# EAGLE design jacarerele2 (EAGLE 6.5.0)
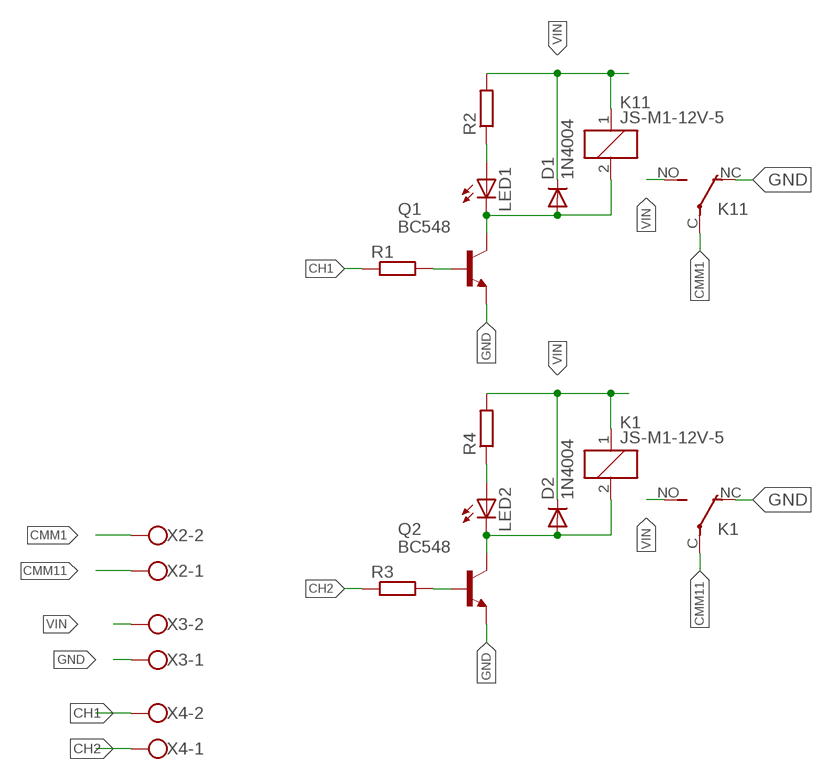
[diagram p0: schematic, sheet 1]

## Parts
D1  1N4004  [DO41-10]
D2  1N4004  [DO41-10]
K1  JS-M1-12V-5  [JS-M]
K11  JS-M1-12V-5  [JS-M]
LED1  LED5MM  [LED5MM]
LED2  LED5MM  [LED5MM]
Q1  BC548  [TO92-EBC]
Q2  BC548  [TO92-EBC]
R1  R-EU_0207/10  [0207/10]
R2  R-EU_0207/10  [0207/10]
R3  R-EU_0207/10  [0207/10]
R4  R-EU_0207/10  [0207/10]
X2  W237-102  [W237-102]
X3  W237-102  [W237-102]
X4  W237-102  [W237-102]

## Nets
CH1: R1.1 X4.2
CH2: R3.1 X4.1
CMM1: K11.C(2:P) X2.2
CMM11: K1.C(2:P) X2.1
GND: K1.NC(2:O) K11.NC(2:O) Q1.E Q2.E X3.1
N$1: Q1.B R1.2
N$2: LED1.A R2.1
N$3: Q2.B R3.2
N$4: LED2.A R4.1
N$5: D1.A K11.2 LED1.K(C) Q1.C
N$6: D2.A K1.2 LED2.K(C) Q2.C
VIN: D1.C D2.C K1.1 K1.NO(2:S) K11.1 K11.NO(2:S) R2.2 R4.2 X3.2

## Library data of the parts
D1 D2 = diode:1N4004: DIODE general purpose rectifier, 1 A
K1 K11 = relay:JS-M1*: Automotive Ultra-Miniature Power Relay NAiS Source: http://www.mew-europe.com/.. en_ds_61211_0000.pdf; MF: FARNELL; MPN: JSM1-12V-5; OC_FARNELL: 910351; OC_NEWARK: 14J1764
LED1 LED2 = led:LED: LED OSRAM: - CHIPLED LG R971, LG N971, LY N971, LG Q971, LY Q971, LO R971, LY R971 LH N974, LH R974 LS Q976, LO Q976, LY Q976 LO Q996 - Hyper CHIPLED LW Q18S LB Q993, LB Q99A, LB R99A - SideLED LS A670, LO A670, LY A670, LG A670, LP A670 LB A673, LV A673, LT A673, LW A673 LH A674 LY A675 LS A676, LA A676, LO A676, LY A676, LW A676 LS A679, LY A679, LG A679 - Hyper Micro SIDELED® LS Y876, LA Y876, LO Y876, LY Y876 LT Y87S - SmartLED LW L88C, LW L88S LB L89C, LB L89S, LG L890 LS L89K, LO L89K, LY L89K LS L896, LA L896, LO L896, LY L896 - TOPLED LS T670, LO T670, LY T670, LG T670, LP T670 LSG T670, LSP T670, LSY T670, LOP T670, LYG T670 LG T671, LOG T671, LSG T671 LB T673, LV T673, LT T673, LW T673 LH T674 LS T676, LA T676, LO T676, LY T676, LB T676, LH T676, LSB T676, LW T676 LB T67C, LV T67C, LT T67C, LS T67K, LO T67K, LY T67K, LW E67C LS E67B, LA E67B, LO E67B, LY E67B, LB E67C, LV E67C, LT E67C LW T67C LS T679, LY T679, LG T679 LS T770, LO T770, LY T770, LG T770, LP T770 LB T773, LV T773, LT T773, LW T773 LH T774 LS E675, LA E675, LY E675, LS T675 LS T776, LA T776, LO T776, LY T776, LB T776 LHGB T686 LT T68C, LB T68C - Hyper Mini TOPLED® LB M676 - Mini TOPLED Santana® LG M470 LS M47K, LO M47K, LY M47K Source: http://www.osram.convergy.de LUXEON: - LUMILED® LXK2-PW12-R00, LXK2-PW12-S00, LXK2-PW14-U00, LXK2-PW14-V00 LXK2-PM12-R00, LXK2-PM12-S00, LXK2-PM14-U00 LXK2-PE12-Q00, LXK2-PE12-R00, LXK2-PE12-S00, LXK2-PE14-T00, LXK2-PE14-U00 LXK2-PB12-K00, LXK2-PB12-L00, LXK2-PB12-M00, LXK2-PB14-N00, LXK2-PB14-P00, LXK2-PB14-Q00 LXK2-PR12-L00, LXK2-PR12-M00, LXK2-PR14-Q00, LXK2-PR14-R00 LXK2-PD12-Q00, LXK2-PD12-R00, LXK2-PD12-S00 LXK2-PH12-R00, LXK2-PH12-S00 LXK2-PL12-P00, LXK2-PL12-Q00, LXK2-PL12-R00 Source: www.luxeon.com KINGBRIGHT: KA-3528ASYC Source: www.kingbright.com
Q1 Q2 = transistor-npn:BC548*: NPN Transistor
R1-R4 = rcl:R-EU_: RESISTOR, European symbol
X2-X4 = con-wago-500:W237-102: WAGO SCREW CLAMP; MPN: 237-102; OC_FARNELL: unknown; OC_NEWARK: 70K9898

## Board
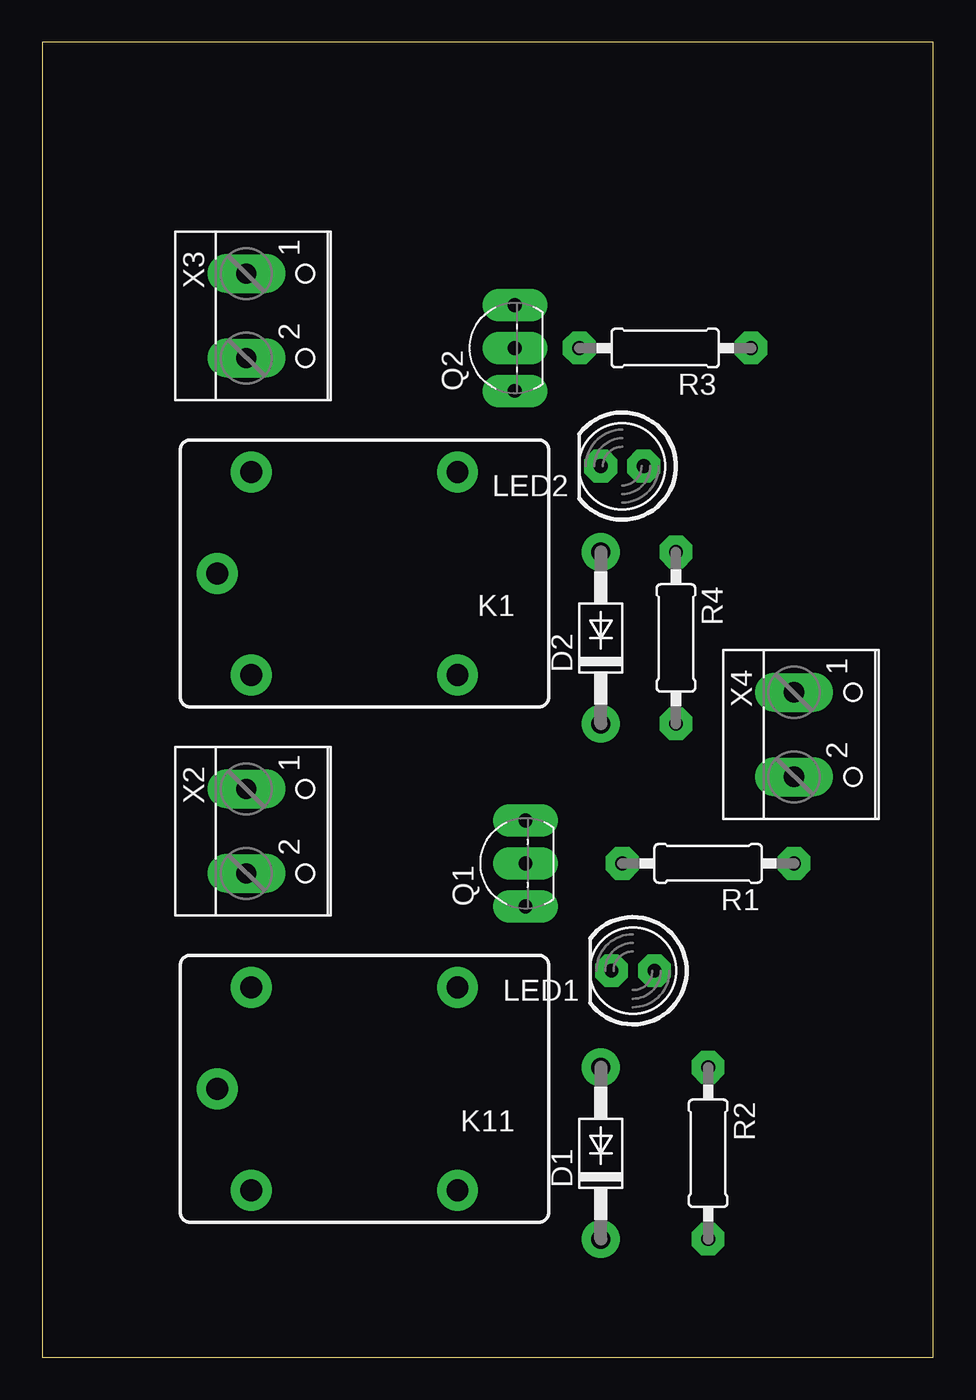
[diagram p1: board, top side]
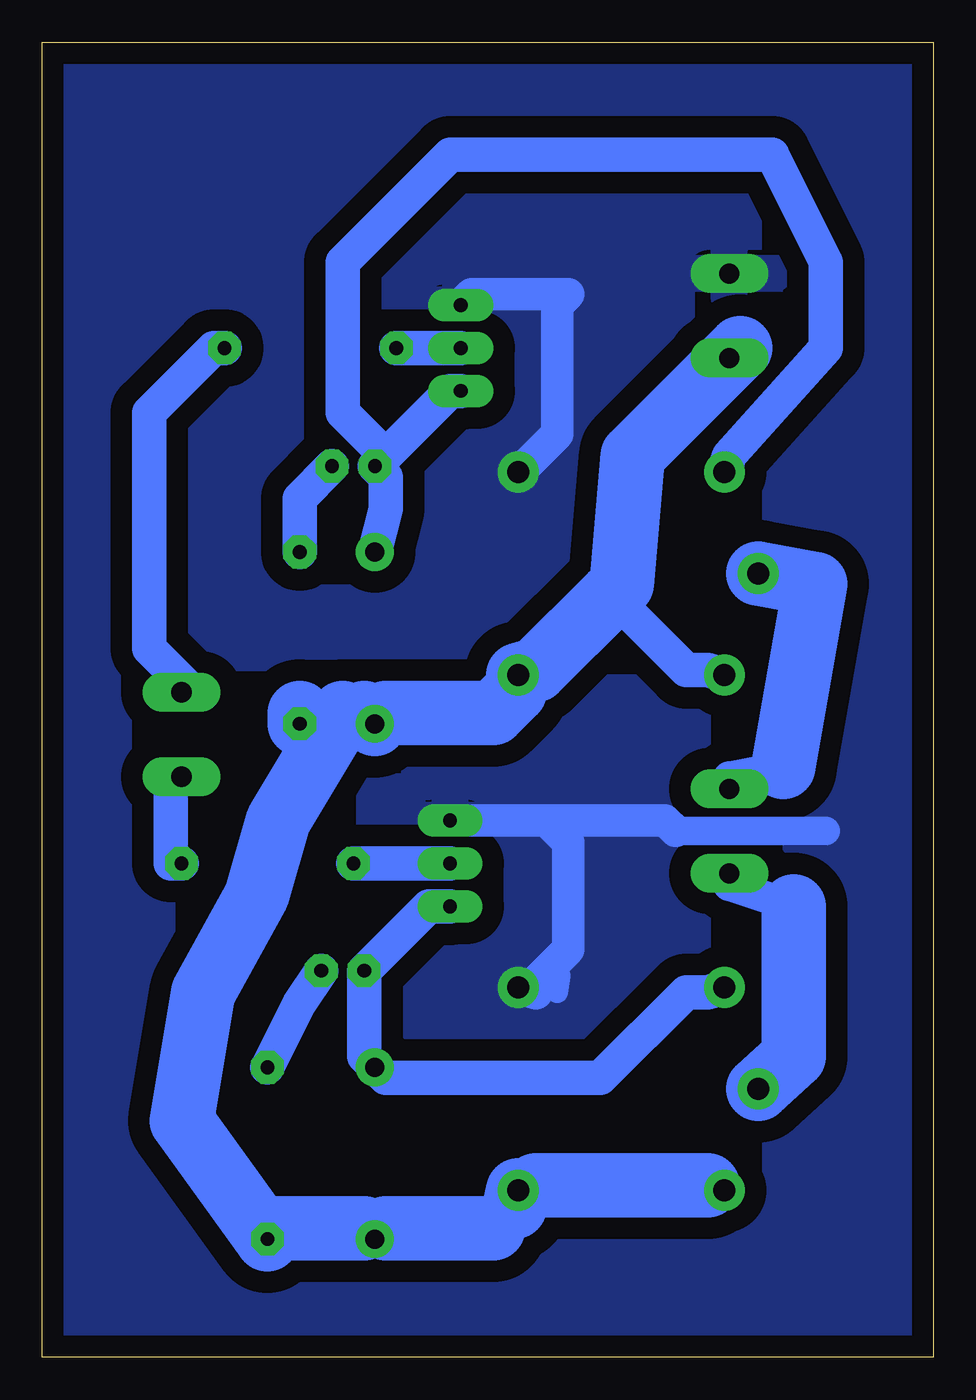
[diagram p2: board, bottom side, seen from below]

Size 52.69 x 77.78 mm. Coordinates in mm from the lower left corner, seen from the top.
Outline: 0,0 52.69,0 52.69,77.78 0,77.78 0,0
Copper layers (1*16): Top 0.035mm / dielectric 1.5mm / Bottom 0.035mm
Design rules "default *": minimum track width 20mil, minimum drill 20mil, track to track 20mil, track to pad 20mil, pad to pad 20mil, via to via 20mil, smd to smd 10mil, copper to edge 40mil, drill to drill 40mil, minimum pad ring 22mil, minimum via ring 20mil, stop-mask expansion 4mil, vias tented up to drill 0mil, thermal gap 10mil

### Footprints (pad centres in the part's own frame; a part is rotated, then mirrored left to right if it is on the bottom)
DO41-10 = drill 1.118: A 5.08,0; C -5.08,0
JS-M = drill 1.3: 1 6.7,6; 2 6.7,-6; C 8.7,0; NC -5.5,-6; NO -5.5,6
LED5MM = drill 0.813 octagon: A -1.27,0; K 1.27,0
TO92-EBC = drill 0.813 long: B 0,-1.27; C -2.54,-1.27; E 2.54,-1.27
0207/10 = drill 0.813 octagon: 1 -5.08,0; 2 5.08,0
W237-102 = drill 1.194 long: 1 -2.5,-1.27; 2 2.5,-1.27

### Placement (x,y rotation side)
D1  33.02,12.07 90 top
D2  33.02,42.55 90 top
K1  19.05,46.36 180 top
K11  19.05,15.88 180 top
LED1  34.93,22.86 180 top
LED2  34.29,52.7 180 top
Q1  27.3,29.21 90 top
Q2  26.67,59.69 90 top
R1  39.37,29.21 180 top
R2  39.37,12.07 270 top
R3  36.83,59.69 180 top
R4  37.47,42.55 270 top
X2  13.34,31.12 270 top
X3  13.34,61.59 270 top
X4  45.72,36.83 270 top

### Tracks (layer width: path | path; a pad name or v marks a point on that pad's centre or on a via)
CH1
  Bottom 2.032: R1.1 45.09,29.21 45.09,34.29 X4.2
CH2
  Bottom 2.032: R3.1 42.55,59.69 46.36,55.88 46.36,41.91 43.82,39.37 X4.1
CMM1
  Bottom 1.93: 8.26,26.67 12.07,27.94 X2.2
  Bottom 3.81: 8.26,26.67 8.26,17.78 K11.C
CMM11
  Bottom 1.93: 8.89,34.93 12.07,34.29 X2.1
  Bottom 3.81: 8.89,34.93 6.99,45.72 K1.C
GND
  Bottom 1.27: 22.23,21.59 22.09,22.58
  Bottom 1.676: 15.24,31.12 6.35,31.12
  Bottom 1.93: Q1.E 22.86,31.75 | 22.86,31.75 15.88,31.75 15.24,31.12 | K1.NC 24.48,52.36 22.23,54.61 22.23,62.23 21.59,62.87 27.3,62.87 Q2.E | K11.NC 23.84,21.88 21.59,24.13 21.59,30.48 22.86,31.75
  Bottom 2.032: 23.5,21.59 K11.NC 23.5,21.59
  pour Bottom (isolate 1.27): 53.34,79.38 53.34,-1.27 1.27,-0.63 1.27,78.74
N$1
  Bottom 2.032: R1.2 Q1.B
N$2
  Bottom 2.032: R2.1 37.47,20.96 LED1.A
N$3
  Bottom 2.032: R3.2 Q2.B
N$4
  Bottom 2.032: R4.1 37.47,50.8 LED2.A
N$5
  Bottom 2.032: Q1.C 29.84,26.67 LED1.K 33.66,17.78 D1.A 32.38,16.51 19.69,16.51 14.61,21.59 13.34,21.59 K11.2
N$6
  Bottom 2.032: D2.A 32.38,50.17 32.38,52.07 LED2.K 32.38,53.34 | 32.38,53.34 28.58,57.15 Q2.C | 32.38,53.34 34.93,55.88 34.93,64.77 28.58,71.12 9.53,71.12 6.35,64.77 6.35,59.69 12.07,53.34 K1.2
VIN
  Bottom 2.032: 38.73,7.62 R2.2 | 33.66,7.62 D1.C 32.38,7.62 | 13.34,10.16 K11.1 | 23.5,10.16 K11.NO | 24.77,8.89 26.04,7.62 | 33.66,38.1 34.93,38.1 37.47,38.1 | 18.41,45.72 19.05,45.09 14.61,40.64 13.34,40.64 K1.1 | 11.43,59.69 X3.2 | 32.38,38.1 D2.C | 24.77,39.37 K1.NO
  Bottom 3.81: 33.66,7.62 38.73,7.62 | 23.5,10.16 13.34,10.16 | 26.04,7.62 32.38,7.62 | 24.77,8.89 K11.NO | 37.47,38.1 R4.2 | 33.66,38.1 D2.C | 11.43,59.69 17.78,53.34 18.41,45.72 | 19.05,45.09 23.5,40.64 K1.NO | 32.38,38.1 26.04,38.1 24.77,39.37 | R2.2 44.45,13.97 43.18,21.59 40.01,27.3 38.73,31.75 34.93,38.1